# EasyEDA Pro project STM32F407ZG_Basics.epro, board PCB1
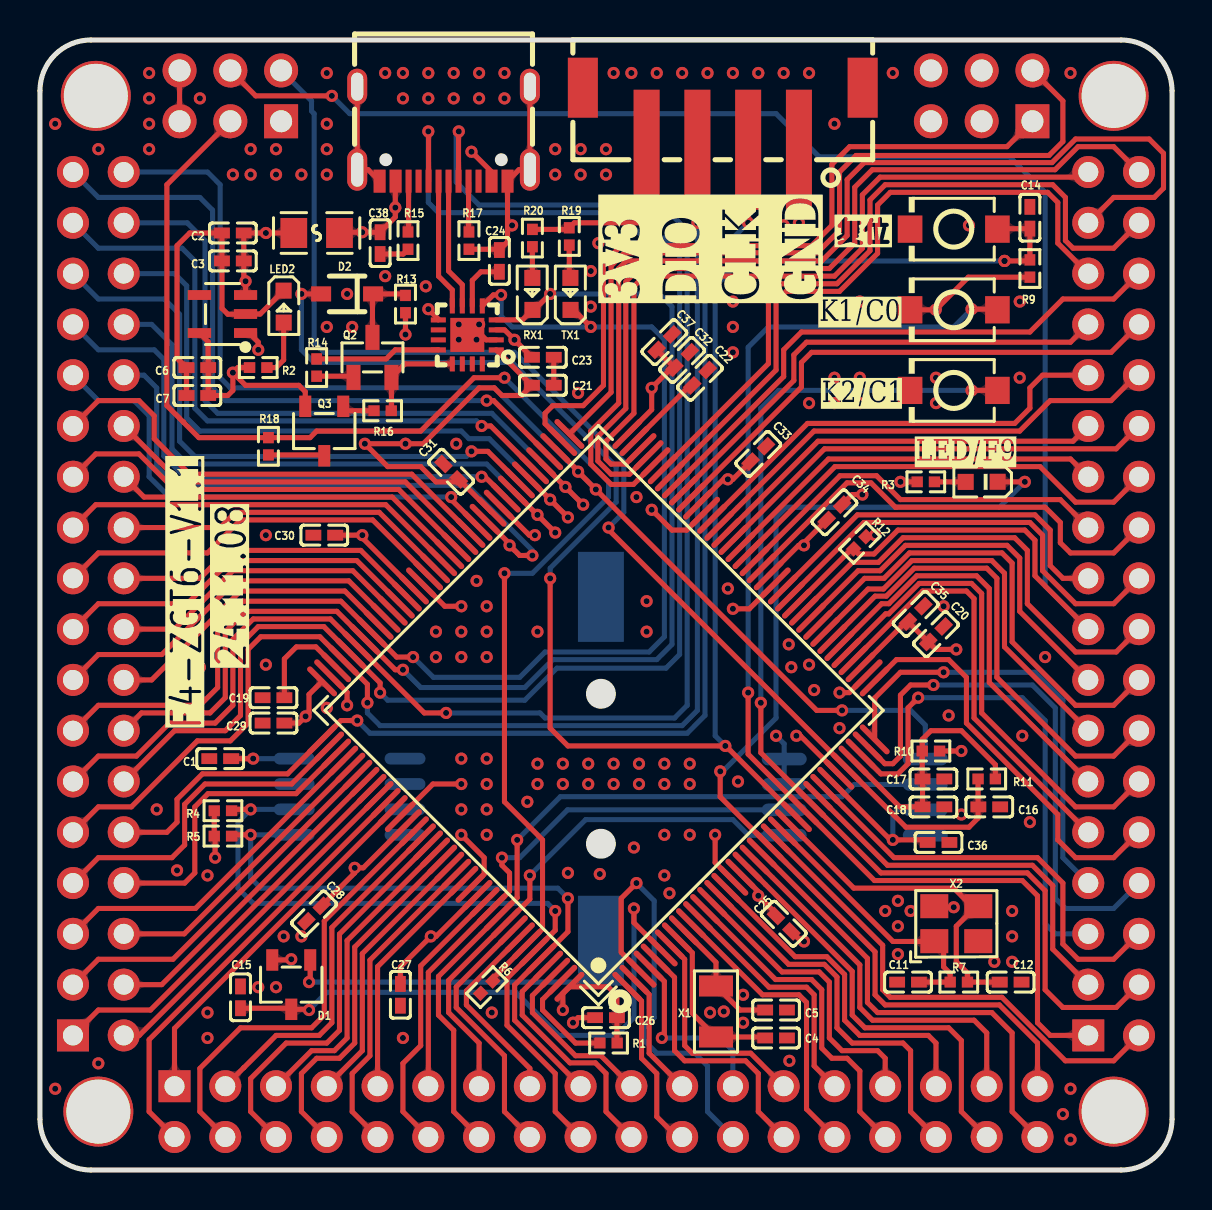
[diagram p1: board, top side]
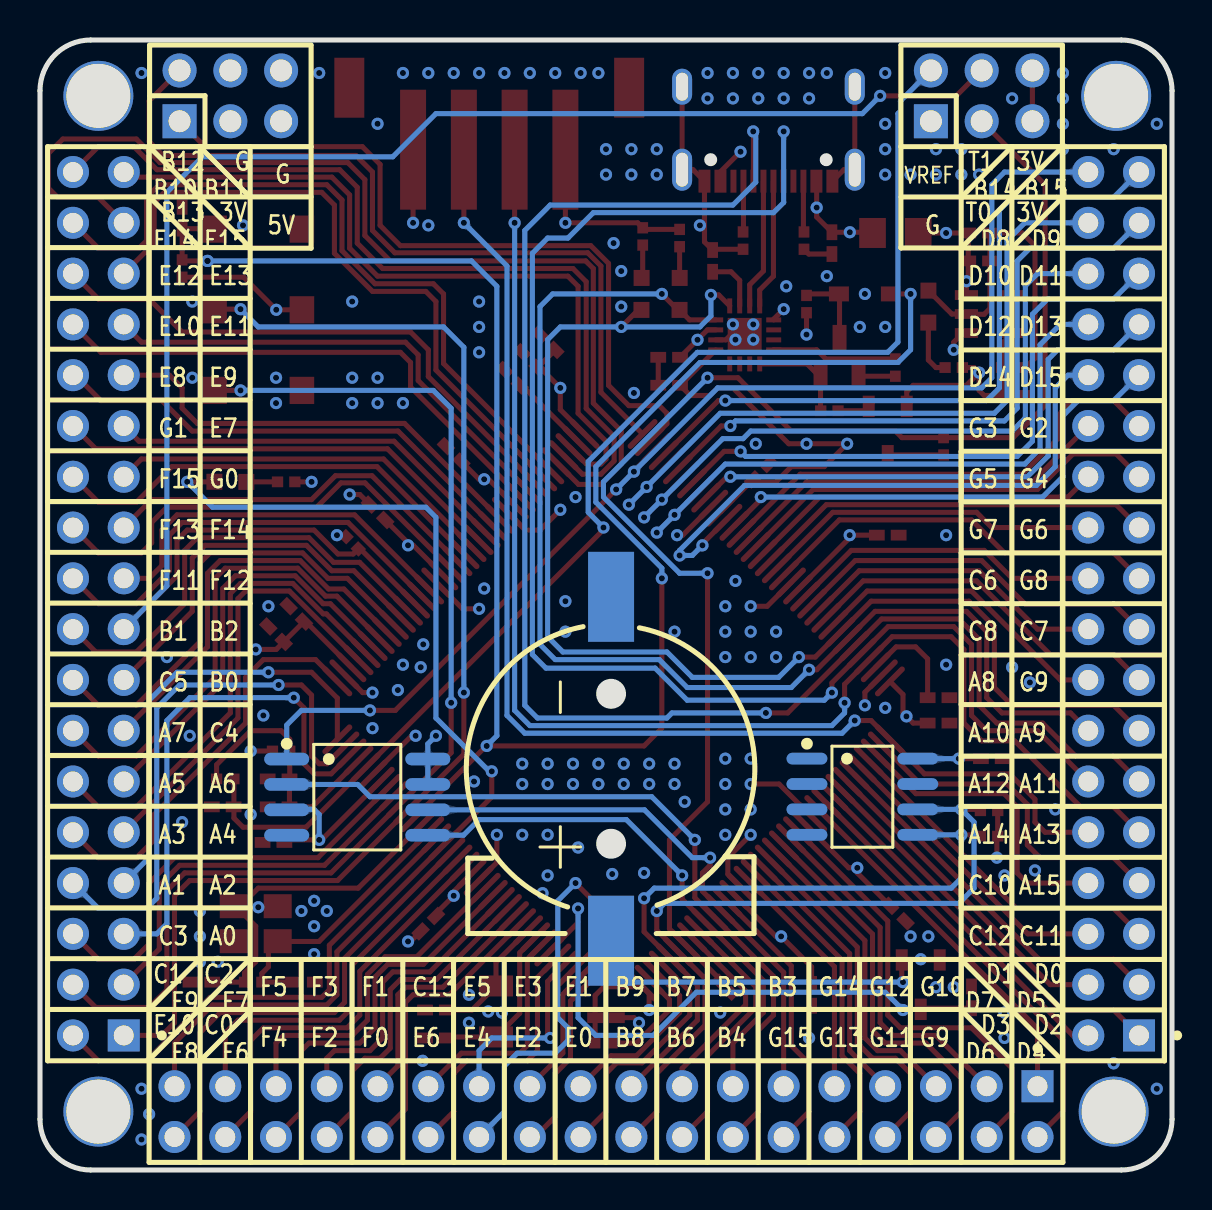
[diagram p2: board, bottom side, seen from below]

Outline 56.64 x 56.51 mm; copper layers: Top Layer, GND, VCC, Bottom Layer. Coordinates in mm from the lower left corner of the outline.
Outline path: 0,53.97 0,2.54 arc(0.74,0.74) 2.54,0 54.1,0 arc(55.9,0.74) 56.64,2.54 56.64,53.97 arc(55.9,55.77) 54.1,56.51 2.54,56.51 arc(0.74,55.77) 0,53.97
Stack: Top Layer 0.035mm 外层铜厚1oz / Dielectric1 0.2104mm 7628 RC49% 8.6mil / GND 0.0152mm 内层铜厚 / Dielectric2 1.065mm 1.1mm H/HOZ 含铜 / VCC 0.0152mm 内层铜厚 / Dielectric3 0.2104mm 7628 RC49% 8.6mil / Bottom Layer 0.035mm 外层铜厚1oz

## Design rules (mm)
template: JLCPCB Capability(Two Layers Board)
spacing copperThickness1oz (default): track to track 0.102, other pairs 0.152 to 0.3
spacing copperThickness2oz: track to track 0.203, other pairs 0.152 to 0.3
track width copperThickness1oz (default): min 0.127, default 0.254, max 2.54
track width copperThickness2oz: min 0.203, default 0.254, max 2.54
differential pair differentialPair (default): width min 0.127, default 0.254, max 2.54; gap min 0.152, default 0.152
via viaSize (default): diameter min 0.5, default 0.61, max 10; hole min 0.3, default 0.305, max 6.3

## Placement (name value [footprint] x y rotation side)
BT1  CR1220-2ZX  [BAT-SMD_CR1220-2ZX]  28.07 20.07 90 bottom
C1  100nF  [C0402]  9.02 20.57 0 top
C2  10uF  [C0402]  9.65 46.86 180 top
C3  100nF  [C0402]  9.65 45.47 0 top
C4  12pF  [C0402]  36.83 6.6 180 top
C5  12pF  [C0402]  36.83 8 180 top
C6  100nF  [C0402]  7.87 40.13 0 top
C7  10uF  [C0402]  7.87 38.73 180 top
C11  22pF  [C0402]  43.43 9.4 0 top
C12  22pF  [C0402]  48.57 9.4 180 top
C14  100nF  [C0402]  49.53 47.62 90 top
C15  100nF  [C0402]  10.03 8.64 270 top
C16  100nF  [C0402]  47.5 18.16 180 top
C17  10uF  [C0402]  44.7 19.56 180 top
C18  100nF  [C0402]  44.7 18.16 0 top
C19  2.2uF  [C0402]  11.68 23.62 180 top
C20  100nF  [C0402]  44.83 26.8 225 top
C21  1uF  [C0402]  25.16 39.25 180 top
C22  2.2uF  [C0402]  33.02 39.62 225 top
C23  100nF  [C0402]  25.16 40.65 180 top
C24  100nF  [C0402]  22.99 45.47 270 top
C25  100nF  [C0402]  37.21 12.32 315 top
C26  100nF  [C0402]  28.32 7.62 180 top
C27  100nF  [C0402]  18.03 8.76 270 top
C28  100nF  [C0402]  13.72 12.83 225 top
C29  100nF  [C0402]  11.68 22.35 180 top
C30  100nF  [C0402]  14.22 31.75 180 top
C31  100nF  [C0402]  20.57 34.92 135 top
C32  100nF  [C0402]  32.13 40.51 45 top
C33  100nF  [C0402]  35.94 35.81 45 top
C34  100nF  [C0402]  39.75 32.89 45 top
C35  100nF  [C0402]  43.81 27.81 45 top
C36  100nF  [C0402]  44.96 16.38 0 top
C37  10uF  [C0402]  31.24 41.4 225 top
C38  10uF  [C0402]  17.02 46.35 270 top
D1  SBAT54CLT1G  [SOT-23-3_L2.9-W1.6-P1.90-LS2.8-BR]  12.57 9.27 90 top
D2  1N5819WS  [SOD-323_L1.6-W1.3-LS2.6-RD-1]  15.37 43.81 180 top
F1  ASMD0805-075  [F0805]  13.84 46.86 180 top
H1  PH-01162  [HDR-TH_PH-01162]  53.72 28.32 90 bottom
H2  PH-01162  [HDR-TH_PH-01162]  28.32 2.92 0 bottom
H3  PH-01162  [HDR-TH_PH-01162]  2.92 28.32 90 bottom
H4  PZ254V-12-6P  [HDR-TH_6P-P2.54-V-M-R2-C3-S2.54]  9.53 53.72 180 bottom
H5  PZ254V-12-6P  [HDR-TH_6P-P2.54-V-M-R2-C3-S2.54]  47.12 53.72 180 bottom
LED1  XL-1608UGC-04  [LED0603-RD_GREEN]  47.12 34.42 180 top
LED2  XL-1608SURC-06  [LED0603-RD_RED]  12.19 43.18 270 top
NOREF  -  [Pad_e156]  53.72 2.92 0 top
NOREF#2  -  [Pad_e157]  2.92 2.92 0 top
NOREF#3  -  [Pad_e153]  2.79 53.72 0 top
NOREF#4  -  [Pad_e155]  53.72 53.72 0 top
Q2  L8050QLT1G  [SOT-23-3_L2.9-W1.3-P1.90-LS2.4-BR]  16.64 40.64 270 top
Q3  L8550QLT1G  [SOT-23-3_L2.9-W1.6-P1.90-LS2.8-BR]  14.22 36.96 90 top
R1  10kΩ  [R0402]  28.45 6.35 0 top
R2  1.5kΩ  [R0402]  10.92 40.13 180 top
R3  1.5kΩ  [R0402]  44.32 34.42 0 top
R4  5.1kΩ  [R0402]  9.15 17.97 180 top
R5  5.1kΩ  [R0402]  9.15 16.7 180 top
R6  10kΩ  [R0402]  22.35 9.14 225 top
R7  1MΩ  [R0402]  45.97 9.4 0 top
R9  10kΩ  [R0402]  49.53 45.08 270 top
R10  0Ω  [R0402]  44.58 20.95 180 top
R11  0Ω  [R0402]  47.37 19.56 180 top
R12  10kΩ  [R0402]  41.02 31.37 225 top
R13  10kΩ  [R0402]  18.29 43.31 270 top
R14  1.5kΩ  [R0402]  13.84 40.13 270 top
R15  5.1kΩ  [R0402]  18.42 46.48 270 top
R16  1.5kΩ  [R0402]  17.15 37.97 180 top
R17  5.1kΩ  [R0402]  21.46 46.48 270 top
R18  120Ω  [R0402]  11.43 36.19 270 top
R19  1.5kΩ  [R0402]  26.48 46.69 270 top
R20  1.5kΩ  [R0402]  24.64 46.61 270 top
RX1  XL-1608SURC-06  [LED0603-RD_RED]  24.64 43.81 90 top
SW1  TS-1088-AR02016  [SW-SMD_L3.9-W3.0-P4.45]  45.72 43.02 180 top
SW2  TS-1088-AR02016  [SW-SMD_L3.9-W3.0-P4.45]  45.72 38.99 180 top
SW3  TS-1088-AR02016  [SW-SMD_L3.9-W3.0-P4.45]  45.72 47.06 180 top
TX1  XL-1608SURC-06  [LED0603-RD_RED]  26.54 43.81 90 top
U1  TPRT9013-33GB  [SOT-23-5_L3.0-W1.7-P0.95-LS2.8-BL]  9.13 42.81 90 top
U2  STM32F407ZGT6  [LQFP-144_L20.0-W20.0-P0.50-LS22.0-BL]  27.94 22.99 45 top
U3  24C02CT/SN  [SOIC-8_L4.9-W3.9-P1.27-LS6.0-BL]  15.49 18.67 270 bottom
U4  ZX-XH2.54-4PLT  [CONN-SMD_4P-P2.54_C9900012758]  34.16 52.58 180 top
U5  W25Q128FVSIG  [SOIC-8_L5.3-W5.3-P1.27-LS8.0-BL]  40.77 18.65 270 bottom
U6  CH343P  [TQFN-16_L3.0-W3.0-P0.50-BL-EP1.7]  21.38 41.77 90 top
USB1  TYPE-C16PIN  [USB-C-SMD_TYPE-C16PIN]  20.19 51.82 180 top
X1  32.768kHz  [OSC-SMD_L3.2-W1.5]  33.82 7.93 90 top
X2  8MHz  [OSC-SMD_4P-L3.2-W2.5-BL]  45.85 12.32 0 top

## Footprints (pads in the part's own frame, mm; a bottom-side part is the same pattern mirrored in y, then rotated)
BAT-SMD_CR1220-2ZX
  rect 4.5x2.3 smd: 1(-8.6,0) 2(8.6,0)
C0402
  rect 0.79x0.54 smd: 1(-0.545,0) 2(0.545,0)
CONN-SMD_4P-P2.54_C9900012758
  rect 1.3x6 smd: 1(-3.811,1.55) 2(-1.27,1.55) 3(1.27,1.55) 4(3.81,1.55)
  rect 1.5x3 smd: 5(7,-1.55) 6(-7,-1.55)
F0805
  rect 1.335x1.5 smd: 1(-1.143,0) 2(1.143,0)
HDR-TH_6P-P2.54-V-M-R2-C3-S2.54
  rect 1.7x1.7 hole 1.1: 1(-2.54,-1.27)
  round 1.7 hole 1.1: 2(-2.54,1.27) 3(0,-1.27) 4(0,1.27) 5(2.54,-1.27) 6(2.54,1.27)
HDR-TH_PH-01162
  rect 1.6x1.6 hole 1: 1(-21.59,-1.27)
  round 1.6 hole 1: 2(-21.59,1.27) 3(-19.05,-1.27) 4(-19.05,1.27) 5(-16.51,-1.27) 6(-16.51,1.27) 7(-13.97,-1.27) 8(-13.97,1.27) 9(-11.43,-1.27) 10(-11.43,1.27) 11(-8.89,-1.27) 12(-8.89,1.27) 13(-6.35,-1.27) 14(-6.35,1.27) 15(-3.81,-1.27) 16(-3.81,1.27) 17(-1.27,-1.27) 18(-1.27,1.27) 19(1.27,-1.27) 20(1.27,1.27) 21(3.81,-1.27) 22(3.81,1.27) 23(6.35,-1.27) 24(6.35,1.27) 25(8.89,-1.27) 26(8.89,1.27) 27(11.43,-1.27) 28(11.43,1.27) 29(13.97,-1.27) 30(13.97,1.27) 31(16.51,-1.27) 32(16.51,1.27) 33(19.05,-1.27) 34(19.05,1.27) 35(21.59,-1.27) 36(21.59,1.27)
LED0603-RD_GREEN
  rect 0.8x0.8 smd: 1(-0.799,-0.004) 2(0.799,0.004)
LED0603-RD_RED
  rect 0.8x0.8 smd: 1(-0.799,-0.004) 2(0.799,0.004)
LQFP-144_L20.0-W20.0-P0.50-LS22.0-BL
  oval 0.28x2 smd: 1(-8.75,-10.8) 2(-8.25,-10.8) 3(-7.75,-10.8) 4(-7.25,-10.8) 5(-6.75,-10.8) 6(-6.25,-10.8) 7(-5.75,-10.8) 8(-5.25,-10.8) 9(-4.75,-10.8) 10(-4.25,-10.8) 11(-3.75,-10.8) 12(-3.25,-10.8) 13(-2.75,-10.8) 14(-2.25,-10.8) 15(-1.75,-10.8) 16(-1.25,-10.8) 17(-0.75,-10.8) 18(-0.25,-10.8) 19(0.25,-10.8) 20(0.75,-10.8) 21(1.25,-10.8) 22(1.75,-10.8) 23(2.25,-10.8) 24(2.75,-10.8) 25(3.25,-10.8) 26(3.75,-10.8) 27(4.25,-10.8) 28(4.75,-10.8) 29(5.25,-10.8) 30(5.75,-10.8) 31(6.25,-10.8) 32(6.75,-10.8) 33(7.25,-10.8) 34(7.75,-10.8) 35(8.25,-10.8) 36(8.75,-10.8) 73(8.75,10.8) 74(8.25,10.8) 75(7.75,10.8) 76(7.25,10.8) 77(6.75,10.8) 78(6.25,10.8) 79(5.75,10.8) 80(5.25,10.8) 81(4.75,10.8) 82(4.25,10.8) 83(3.75,10.8) 84(3.25,10.8) 85(2.75,10.8) 86(2.25,10.8) 87(1.75,10.8) 88(1.25,10.8) 89(0.75,10.8) 90(0.25,10.8) 91(-0.25,10.8) 92(-0.75,10.8) 93(-1.25,10.8) 94(-1.75,10.8) 95(-2.25,10.8) 96(-2.75,10.8) 97(-3.25,10.8) 98(-3.75,10.8) 99(-4.25,10.8) 100(-4.75,10.8) 101(-5.25,10.8) 102(-5.75,10.8) 103(-6.25,10.8) 104(-6.75,10.8) 105(-7.25,10.8) 106(-7.75,10.8) 107(-8.25,10.8) 108(-8.75,10.8)
  oval 2x0.28 smd: 37(10.8,-8.75) 38(10.8,-8.25) 39(10.8,-7.75) 40(10.8,-7.25) 41(10.8,-6.75) 42(10.8,-6.25) 43(10.8,-5.75) 44(10.8,-5.25) 45(10.8,-4.75) 46(10.8,-4.25) 47(10.8,-3.75) 48(10.8,-3.25) 49(10.8,-2.75) 50(10.8,-2.25) 51(10.8,-1.75) 52(10.8,-1.25) 53(10.8,-0.75) 54(10.8,-0.25) 55(10.8,0.25) 56(10.8,0.75) 57(10.8,1.25) 58(10.8,1.75) 59(10.8,2.25) 60(10.8,2.75) 61(10.8,3.25) 62(10.8,3.75) 63(10.8,4.25) 64(10.8,4.75) 65(10.8,5.25) 66(10.8,5.75) 67(10.8,6.25) 68(10.8,6.75) 69(10.8,7.25) 70(10.8,7.75) 71(10.8,8.25) 72(10.8,8.75) 109(-10.8,8.75) 110(-10.8,8.25) 111(-10.8,7.75) 112(-10.8,7.25) 113(-10.8,6.75) 114(-10.8,6.25) 115(-10.8,5.75) 116(-10.8,5.25) 117(-10.8,4.75) 118(-10.8,4.25) 119(-10.8,3.75) 120(-10.8,3.25) 121(-10.8,2.75) 122(-10.8,2.25) 123(-10.8,1.75) 124(-10.8,1.25) 125(-10.8,0.75) 126(-10.8,0.25) 127(-10.8,-0.25) 128(-10.8,-0.75) 129(-10.8,-1.25) 130(-10.8,-1.75) 131(-10.8,-2.25) 132(-10.8,-2.75) 133(-10.8,-3.25) 134(-10.8,-3.75) 135(-10.8,-4.25) 136(-10.8,-4.75) 137(-10.8,-5.25) 138(-10.8,-5.75) 139(-10.8,-6.25) 140(-10.8,-6.75) 141(-10.8,-7.25) 142(-10.8,-7.75) 143(-10.8,-8.25) 144(-10.8,-8.75)
OSC-SMD_4P-L3.2-W2.5-BL
  rect 1.4x1.2 smd: 1(-1.1,-0.875) 2(1.1,-0.875) 3(1.1,0.875) 4(-1.1,0.875)
OSC-SMD_L3.2-W1.5
  rect 1.05x1.7 smd: 1(-1.275,0) 2(1.275,0)
Pad_e153
  round 3.5 hole 3.2: 1(0,0)
Pad_e155
  round 3.5 hole 3.2: 2(0,0)
Pad_e156
  round 3.5 hole 3.2: 3(0,0)
Pad_e157
  round 3.5 hole 3.2: 4(0,0)
R0402
  rect 0.566x0.54 smd: 1(-0.433,0) 2(0.433,0)
SOD-323_L1.6-W1.3-LS2.6-RD-1
  rect 1x0.75 smd: 1(-1.3,0) 2(1.3,0)
SOIC-8_L4.9-W3.9-P1.27-LS6.0-BL
  oval 0.588x2.045 smd: 1(-1.905,-2.772) 2(-0.635,-2.772) 3(0.635,-2.772) 4(1.905,-2.772) 5(1.905,2.772) 6(0.635,2.772) 7(-0.635,2.772) 8(-1.905,2.772)
SOIC-8_L5.3-W5.3-P1.27-LS8.0-BL
  oval 0.63x2.25 smd: 1(-1.905,-3.53) 2(-0.635,-3.53) 3(0.635,-3.53) 4(1.905,-3.53) 5(1.905,3.53) 6(0.635,3.53) 7(-0.635,3.53) 8(-1.905,3.53)
SOT-23-3_L2.9-W1.3-P1.90-LS2.4-BR
  rect 1.25x0.7 smd: 1(1,-0.95) 2(1,0.95) 3(-1,0)
SOT-23-3_L2.9-W1.6-P1.90-LS2.8-BR
  rect 1.07x0.6 smd: 1(1.235,-0.95) 2(1.235,0.95) 3(-1.235,0)
SOT-23-5_L3.0-W1.7-P0.95-LS2.8-BL
  rect 0.49x1.157 smd: 1(-0.95,-1.153) 2(0,-1.153) 3(0.95,-1.153)
  rect 0.49x1.175 smd: 4(0.95,1.153) 5(-0.95,1.153)
SW-SMD_L3.9-W3.0-P4.45
  rect 1.23x1.36 smd: 1(-2.185,0) 2(2.185,0)
TQFN-16_L3.0-W3.0-P0.50-BL-EP1.7
  rect 0.25x0.75 smd: 1(-0.749,-1.45) 2(-0.248,-1.45) 3(0.252,-1.45) 4(0.751,-1.45) 9(0.75,1.45) 10(0.25,1.45) 11(-0.25,1.45) 12(-0.749,1.45)
  rect 0.75x0.25 smd: 5(1.45,-0.75) 6(1.45,-0.25) 7(1.45,0.25) 8(1.45,0.75) 13(-1.45,0.75) 14(-1.45,0.25) 15(-1.45,-0.25) 16(-1.45,-0.75)
  rect 1.7x1.7 smd: 17(0.001,0)
USB-C-SMD_TYPE-C16PIN
  oval 1x2.1 hole 0.6x1.7: 1(-4.32,1.788) 2(4.32,1.788)
  oval 1x1.8 hole 0.6x1.4: 3(-4.32,-2.362) 4(4.32,-2.362)
  rect 0.6x1.15 smd: A1B12(-3.2,2.362) A4B9(-2.4,2.362) B1A12(3.2,2.362) B4A9(2.4,2.362)
  rect 0.3x1.15 smd: A5(-1.25,2.362) A6(-0.25,2.362) A7(0.25,2.362) A8(-1.75,2.362) B5(1.75,2.362) B6(0.75,2.362) B7(-0.75,2.362) B8(1.25,2.362)

## Nets
3V3: C1.2 C6.2 C7.1 C20.2 C21.2 C25.1 C26.1 C27.1 C28.1 C29.1 C30.1 C31.1 C32.1 C33.1 C34.1 C35.1 C36.1 C37.2 D1.2 H4.5 H4.6 H5.3 Q3.2 R1.2 R2.2 R3.1 R4.2 R5.2 R9.2 R10.1 R13.2 R19.1 R20.1 SW1.2 U1.5 U2.17 U2.30 U2.39 U2.52 U2.62 U2.72 U2.84 U2.95 U2.108 U2.121 U2.131 U2.144 U3.8 U4.4 U5.3 U5.7 U5.8 U6.1
+5V: C2.1 C3.2 C23.2 F1.2 H5.5 U1.1 U1.3 U6.3 U6.9
GND: BT1.2 C1.1 C2.2 C3.1 C4.1 C5.1 C6.1 C7.2 C11.1 C12.1 C14.2 C15.1 C16.1 C17.1 C18.2 C19.2 C20.1 C21.1 C22.1 C23.1 C24.1 C25.2 C26.2 C27.2 C28.2 C29.2 C30.2 C31.2 C32.2 C33.2 C34.2 C35.2 C36.2 C37.1 C38.2 H4.1 H5.4 H5.6 LED2.1 R6.2 R12.1 R15.2 R17.2 SW2.2 SW3.2 U1.2 U2.16 U2.31 U2.38 U2.51 U2.61 U2.83 U2.94 U2.107 U2.120 U2.130 U3.1 U3.2 U3.3 U3.4 U3.7 U4.1 U5.4 U6.2 U6.17 USB1.1 USB1.2 USB1.3 USB1.4 USB1.A1B12 USB1.B1A12 X2.2 X2.4
VBUS: C38.1 F1.1 USB1.A4B9 USB1.B4A9
VDDA: C17.2 C18.1 R10.2 R11.1 U2.33
BOOT0: H4.3 R6.1 R18.1 U2.138
CS_F: H3.36 U2.75 U5.1
DN/D-: U6.8 USB1.A7
DP/D+: U6.7 USB1.A6
DTR: R14.1 U6.12
IIC_SCL: H2.18 R4.1 U2.139 U3.6
IIC_SDA: H2.17 R5.1 U2.140 U3.5
PA0: H1.5 U2.34
PA1: H1.8 U2.35
PA2: H1.7 U2.36
PA3: H1.10 U2.37
PA4: H1.9 U2.40
PA5: H1.12 U2.41
PA6: H1.11 U2.42
PA7: H1.14 U2.43
PA8: H3.16 U2.100
PA9/TX1: H3.13 TX1.1 U2.101 U6.5
PA10/RX1: H3.14 RX1.1 U2.102 U6.4
PA11/USB_D-: H3.11 U2.103 USB1.B7
PA12/USB_D+: H3.12 U2.104 USB1.B6
PA13/SWDIO: H3.9 U2.105 U4.3
PA14/SWCLK: H3.10 U2.109 U4.2
PA15: H3.7 U2.110
PB0: H1.15 U2.46
PB1: H1.18 U2.47
PB2/BOOT1: H1.17 H4.4 R12.2 U2.48
PB3: H2.11 U2.133 U5.6
PB4: H2.14 U2.134 U5.2
PB5: H2.13 U2.135 U5.5
PB6: H2.16 U2.136
PB7: H2.15 U2.137
PB10: H1.36 U2.69
PB11: H1.35 U2.70
PB12: H5.2 U2.73
PB13: H5.1 U2.74
PB15: H3.35 U2.76
PC0/K1: H1.1 SW1.1 U2.26
PC1/K2: H1.4 SW2.1 U2.27
PC2: H1.3 U2.28
PC3: H1.6 U2.29
PC4: H1.13 U2.44
PC5: H1.16 U2.45
PC6: H3.20 U2.96
PC7: H3.17 U2.97
PC8: H3.18 U2.98
PC9: H3.15 U2.99
PC10: H3.8 U2.111
PC11: H3.5 U2.112
PC12: H3.6 U2.113
PC13: H2.25 U2.7
PC14: C4.2 U2.8 X1.1
PC15: C5.2 U2.9 X1.2
PD0: H3.3 U2.114
PD1: H3.4 U2.115
PD2: H3.1 U2.116
PD3: H3.2 U2.117
PD4: H2.2 U2.118
PD5: H2.1 U2.119
PD6: H2.4 U2.122
PD7: H2.3 U2.123
PD8: H3.34 U2.77
PD9: H3.33 U2.78
PD10: H3.32 U2.79
PD11: H3.31 U2.80
PD12: H3.30 U2.81
PD13: H3.29 U2.82
PD14: H3.28 U2.85
PD15: H3.27 U2.86
PE0: H2.20 U2.141
PE1: H2.19 U2.142
PE2: H2.22 U2.1
PE3: H2.21 U2.2
PE4: H2.24 U2.3
PE5: H2.23 U2.4
PE6: H2.26 U2.5
PE7: H1.25 U2.58
PE8: H1.28 U2.59
PE9: H1.27 U2.60
PE10: H1.30 U2.63
PE11: H1.29 U2.64
PE12: H1.32 U2.65
PE13: H1.31 U2.66
PE14: H1.34 U2.67
PE15: H1.33 U2.68
PF0: H2.28 U2.10
PF1: H2.27 U2.11
PF2: H2.30 U2.12
PF3: H2.29 U2.13
PF4: H2.32 U2.14
PF5: H2.31 U2.15
PF6: H2.34 U2.18
PF7: H2.33 U2.19
PF8: H2.36 U2.20
PF9/TIM14_CH1: H2.35 LED1.1 U2.21
PF10: H1.2 U2.22
PF11: H1.20 U2.49
PF12: H1.19 U2.50
PF13: H1.22 U2.53
PF14: H1.21 U2.54
PF15: H1.24 U2.55
PG0: H1.23 U2.56
PG1: H1.26 U2.57
PG2: H3.25 U2.87
PG3: H3.26 U2.88
PG4: H3.23 U2.89
PG5: H3.24 U2.90
PG6: H3.21 U2.91
PG7: H3.22 U2.92
PG8: H3.19 U2.93
PG9: H2.6 U2.124
PG10: H2.5 U2.125
PG11: H2.8 U2.126
PG12: H2.7 U2.127
PG13: H2.10 U2.128
PG14: H2.9 U2.129
PG15: H2.12 U2.132
PH0: C11.2 R7.1 U2.23 X2.1
PH1: C12.2 R7.2 U2.24 X2.3
POWER: C15.2 D1.3 U2.6
RST: C14.1 D2.2 R9.1 SW3.1 U2.25
RTS: Q2.2 R16.1 U6.13
VREF: C16.2 H4.2 R11.2 U2.32
$1N3432: R1.1 U2.143
$1N3503: C19.1 U2.106
$1N3607: C22.2 U2.71
$1N5532: BT1.1 D1.1
$1N6115: LED2.2 R2.1
$1N7262: R15.1 USB1.B5
$1N7303: R17.1 USB1.A5
$1N7864: C24.2 U6.6
$1N8061: R19.2 TX1.2
$1N8103: R20.2 RX1.2
$1N8304: Q2.1 R14.2
$1N8343: D2.1 Q2.3 R13.1
$1N8469: Q3.1 R16.2
$1N18412: LED1.2 R3.2
$1N26831: Q3.3 R18.2

Pads without a net: NOREF 3; NOREF#2 4; NOREF#3 1; NOREF#4 2; U1 4; U4 5 6; U6 10 11 14 15 16; USB1 A8 B8

## Via types
v1: diameter 0.61, hole 0.305, Top Layer to Bottom Layer, 270 vias

## Routing (per net, layer and track width the routed paths; a pad name or vN(x,y) marks a point on that pad's centre or on a via; arc(x,y) is an arc through that point)
3V3: length 120.4
  Top Layer w0.254: D1.2 12.54,10.51 v1(12.57,10.54) ; v1(26.16,8) 26.16,8.83 26.49,9.16 28.43,9.16 28.87,8.73 C26.1 28.87,6.36 R1.2 ; H4.6 H4.5 ; C30.1 v1(16.13,31.75) 16.13,31.62 18.71,29.03 ; R20.1 26.4,47.04 R19.1 26.73,47.37 v1(30.35,47.37) U4.4 ; R13.2 v1(18.29,41.78) ; C29.1 12.95,22.35 13.46,22.86 13.46,23.78 U2.108 ; 22.6,32.92 22.58,32.92 C31.1 20.84,34.42 19.81,34.42 19.05,35.18 17.4,35.18 v1(16.26,36.32) v1(18.29,36.32) 19.18,36.32 21.97,39.12 22.73,39.12 23.11,38.73 24.1,38.73 C21.2 24.6,39.25 22.83,41.02 ; C37.2 C32.1 31.62,40.13 v1(30.61,39.12) 30.61,38.03 U2.72 ; C25.1 36.83,12.83 v1(35.94,13.72) 35.94,13.93 U2.17 ; SW1.2 v1(44.82,43.02) 46.45,44.65 R9.2 ; R4.2 R5.2 8.76,16.66 v1(8.76,15.62) ; v1(9.65,39.88) 10.29,39.24 12.95,39.24 13.27,38.92 Q3.2 ; v1(9.65,39.88) 9.91,40.13 R2.2 ; v1(9.65,39.88) 9.65,38.99 9.4,38.73 8.42,38.73 8.42,41.42 U1.5 ; C28.1 15.75,14.86 v1(15.75,15.11) 16.18,15.11 U2.121 ; C33.1 34.67,34.54 v1(34.42,34.54) 34.19,34.54 32.93,33.28 ; R10.1 v1(46.1,20.95) ; v1(43.05,34.42) R3.1 ; U2.30 42.55,16.51 v1(42.67,16.51) 44.29,16.51 C36.1 ; v1(45.85,26.03) 44.82,26.03 C20.2 C35.1 43.34,27.43 U2.39 ; C27.1 18.03,10.16 v1(19.56,11.68) 19.82,11.68 21.89,13.76 ; U2.52 37.96,31.24 v1(38.23,31.24) 38.23,31.37 C34.1 ; v1(10.67,20.57) C1.2
  Bottom Layer w0.254: 44.3,18.01 44.28,18.03 42.93,18.03 42.67,17.78 v1(42.67,16.51) ; U5.7 U5.8 37.24,21.31 v1(36.83,21.72) ; v1(10.67,20.57) 12.34,20.57
  vias: v1(13.29,22.69)
+5V: length 9.9
  Top Layer w0.254: v1(19.43,43.05) 19.93,42.55 U6.9 ; U1.3 v1(10.29,44.45) 10.2,44.54 C3.2 C2.1 v1(11.3,46.86) F1.2 ; v1(10.92,41.02) 10.92,41.4 10.46,41.86 U1.1 ; 22.83,42.02 23.25,42.02 v1(23.74,41.52) C23.2
GND: length 72.8
  Top Layer w0.254: v1(38.23,11.43) 38.1,11.43 C25.2 ; v1(30.61,33.02) 31.62,32 32.36,32 33.28,32.92 ; LED2.1 11.02,42.81 U1.2 10.28,42.8 9.4,42.8 9.11,43.09 C3.1 C2.2 7.49,46.86 6.86,46.23 6.86,40.6 C6.1 C7.2 ; C26.2 26.92,7.62 v1(26.67,7.37) ; U6.17 22.08,41.77 22.33,41.52 22.83,41.52 ; v1(40,23.88) 40.5,23.88 U2.38 ; v1(37.85,21.72) 38.05,21.72 U2.31 ; v1(15.37,23.24) 15.37,23.89 U2.107 ; U2.130 22.22,14.8 22.22,15.62 v1(21.08,16.76) ; 18.42,46.05 18.18,45.81 C38.2 ; 22.96,33.28 24.48,31.75 v1(24.77,31.75) ; v1(33.78,16.76) 33.78,15.38 U2.16 ; 16.99,49.45 16.42,50.03 USB1.2 USB1.4 ; U4.1 v1(37.97,47.37) ; C21.1 C23.1 ; v1(41.15,33.78) 40.64,33.78 C34.2 ; v1(34.67,28.07) 35.5,28.07 U2.51 ; v1(21.08,19.3) 19.66,19.3 18,17.65 ; U2.94 20.26,28.19 v1(21.08,28.19) ; USB1.3 USB1.1 23.97,50.03 USB1.A1B12 23.39,46.42 22.99,46.01 22.95,46.05 21.46,46.05
  vias: v1(0.76,52.32) v1(0.76,4.06) v1(2.92,51.05) v1(2.92,5.33) v1(5.46,54.86) v1(5.46,53.59) v1(5.46,52.32) v1(5.46,51.05) v1(5.84,18.03) v1(6.86,14.99) v1(7.11,24.38) v1(8,53.59) v1(8,25.15) v1(8.38,14.73) v1(8.38,7.87) v1(8.38,6.6) v1(9.65,49.78) v1(10.54,51.05) v1(10.54,49.78) v1(10.92,9.14) v1(11.3,31.75) v1(11.3,25.27) v1(11.81,51.05) v1(11.81,49.78) v1(11.81,9.14) v1(12.19,11.68) v1(13.08,49.78) v1(13.08,11.68) v1(14.35,54.86) v1(14.35,52.32) v1(14.35,51.05) v1(14.35,49.78) v1(14.35,42.16) v1(14.35,23.11) v1(15.37,43.81) v1(15.62,42.16) v1(17.27,54.86) v1(17.27,44.7) v1(18.16,54.86) v1(18.16,53.59) v1(18.16,6.6) v1(19.3,44.2) v1(19.43,54.86) v1(19.43,53.59) v1(19.81,26.92) v1(19.81,25.65) v1(20.7,54.86) v1(20.7,53.59) v1(20.83,36.32) v1(20.96,42.29) v1(20.96,41.53) v1(21.08,26.92) v1(21.08,25.65) v1(21.08,20.57) v1(21.08,18.03) v1(21.84,41.53) v1(21.84,29.46) v1(21.97,54.86) v1(21.97,53.59) v1(21.97,42.29) v1(22.35,28.19) v1(22.35,26.92) v1(22.35,25.65) v1(22.35,20.57) v1(22.35,19.3) v1(22.35,18.03) v1(22.35,16.76) v1(22.61,7.87) v1(23.24,54.86) v1(23.24,53.59) v1(23.62,47.24) v1(24.38,18.41) v1(24.89,26.92) v1(24.89,20.32) v1(24.89,19.3) v1(25.78,51.05) v1(25.78,49.78) v1(26.16,20.32) v1(26.16,19.3) v1(26.42,14.86) v1(26.92,38.86) v1(27.05,51.05) v1(27.05,49.78) v1(27.43,20.32) v1(27.43,19.3) v1(27.56,44.96) v1(27.56,43.18) v1(27.94,46.35) v1(28.01,14.8) v1(28.32,51.05) v1(28.32,49.78) v1(28.7,54.86) v1(28.7,20.32) v1(28.7,19.3) v1(29.59,54.86) v1(29.72,16.13) v1(29.84,33.65) v1(29.97,20.32) v1(29.97,19.3) v1(30.35,28.45) v1(30.35,26.92) v1(30.86,54.86) v1(31.24,20.32) v1(31.24,19.3) v1(31.24,16.76) v1(31.24,14.73) v1(31.5,13.84) v1(32.13,54.86) v1(32.51,20.32) v1(32.51,19.3) v1(32.51,16.76) v1(33.4,54.86) v1(33.53,7.87) v1(34.21,7.93) v1(34.42,29.08) v1(34.67,54.86) v1(34.67,43.43) v1(34.67,42.16) v1(34.67,40.89) v1(34.93,19.43) v1(35.18,8.76) v1(35.18,7.37) v1(35.94,54.86) v1(37.21,54.86) v1(37.21,47.24) v1(37.47,26.29) v1(37.5,5.46) v1(37.59,25.15) v1(38.48,54.86) v1(38.48,38.35) v1(38.48,25.27) v1(38.74,24) v1(39.75,52.32) v1(39.75,39.62) v1(39.75,38.35) v1(40,22.1) v1(41.02,43.43) v1(41.02,39.62) v1(41.02,38.35) v1(41.78,31.75) v1(42.29,12.95) v1(42.67,54.86) v1(42.93,13.46) v1(42.93,12.19) v1(42.93,10.79) v1(43.56,12.95) v1(44.83,39.62) v1(44.83,38.35) v1(45.21,28.19) v1(45.47,22.73) v1(45.72,13.14) v1(46.1,17.78) v1(46.48,47.24) v1(47.75,10.41) v1(48.64,12.95) v1(48.64,11.68) v1(48.64,10.41) v1(49.02,43.43) v1(49.02,39.62) v1(49.15,21.72) v1(49.53,17.4) v1(50.29,25.65) v1(51.18,2.79) v1(51.56,54.86) v1(51.56,4.06) v1(51.56,1.52)
VBUS: length 6.8
  Top Layer w0.254: F1.1 15.02,46.9 v1(16.12,46.9) C38.1 17.78,47.66 v1(17.78,48.13) 17.78,49.44 USB1.B4A9 ; USB1.A4B9 22.59,49.92 v1(21.59,50.93)
VDDA: length 13.1
  Top Layer w0.254: R11.1 47.8,20.27 46.1,21.97 44.58,21.97 44.14,21.54 R10.2 44.14,19.57 C17.2 C18.1 43.02,18.16 U2.33
BOOT0: length 71.5
  Top Layer w0.254: 7.18,37.4 7.95,36.63 R18.1 13.51,36.63 13.84,36.96 19.05,36.96 21.72,39.62 v1(23.24,39.62) ; 7.18,37.4 6.35,38.23 6.35,49.28 H4.3 ; 7.18,37.4 7.19,37.41 ; v1(23.24,29.84) 23.24,18.41 25.15,16.51 25.15,12.06 24.37,11.28 22.66,9.57 R6.1
  Bottom Layer w0.254: v1(23.24,39.62) 28.45,34.42 28.45,33.65 24.64,29.84 v1(23.24,29.84)
CS_F: length 61.8
  Top Layer w0.254: v1(40.13,22.99) 38.86,22.99 v1(27.81,34.04) v1(26.92,34.92) 26.92,34.96 U2.75
  Bottom Layer w0.254: v1(27.81,34.04) v1(26.92,34.92) 22.73,39.12 9.53,39.12 9.02,39.62 9.02,49.28 8.38,49.91 H3.36 ; v1(40.13,22.99) 43.56,22.99 44.3,22.25 U5.1
DN/D-: length 6.5
  Top Layer w0.254: U6.8 20.63,44.01 19.94,44.7 USB1.A7
DP/D+: length 6.5
  Top Layer w0.254: USB1.A6 20.44,44.96 21.13,44.27 U6.7
DTR: length 6.3
  Top Layer w0.254: R14.1 17.32,40.56 17.78,41.02 19.93,41.02 U6.12
IIC_SCL: length 37.2
  Top Layer w0.254: v1(25.78,12.95) 25.78,11.99 U2.139 23.37,9.58 23.37,7.24 25.78,4.83 25.78,2.92 27.05,1.65 ; R4.1 9.65,18.03 v1(10.54,18.03)
  Bottom Layer w0.254: 12.34,18.03 v1(10.54,18.03) 9.91,17.4 9.91,14.1 10.67,13.33 25.4,13.33 v1(25.78,12.95)
IIC_SDA: length 33.1
  Top Layer w0.254: R5.1 9.65,16.76 v1(10.54,16.76) ; 27.05,4.19 23.75,7.49 23.75,9.25 U2.140 26.42,11.92 v1(26.42,13.59)
  Bottom Layer w0.254: v1(26.42,13.59) 25.91,14.1 11.05,14.1 10.54,14.6 v1(10.54,16.76) 12.34,16.76
PA0: length 25.9
  Top Layer w0.254: U2.34 42.08,19.81 42.93,19.81 43.43,20.32 43.43,23.11 v1(43.94,23.62)
  Bottom Layer w0.254: v1(43.94,23.62) 49.15,23.62 50.29,22.48 50.29,12.32 50.8,11.81 H1.5
PA1: length 28.1
  Top Layer w0.254: U2.35 42.27,20.32 42.67,20.32 43.05,20.7 43.05,23.75 43.56,24.26 v1(44.7,24.26)
  Bottom Layer w0.254: H1.8 53.72,13.08 51.31,13.08 50.8,13.59 50.8,23.11 49.66,24.26 v1(44.7,24.26)
PA2: length 22.3
  Top Layer w0.254: v1(45.21,24.89) 43.05,24.89 41.76,23.6 U2.36
  Bottom Layer w0.254: v1(45.21,24.89) 49.78,24.89 51.18,23.49 51.18,15.62 H1.7
PA3: length 20.4
  Top Layer w0.254: H1.10 53.72,15.62 51.82,15.62 50.93,16.51 50.93,17.78 46.36,22.35 46.36,24.64 45.47,25.53 42.85,25.53 U2.37
PA4: length 21.7
  Top Layer w0.254: H1.9 46.74,22.61 46.74,28.57 46.36,28.96 44.16,28.96 U2.40
PA5: length 24.7
  Top Layer w0.254: U2.41 42.31,27.81 42.47,27.81 43.99,29.34 46.61,29.34 47.12,28.83 47.12,22.86 51.82,18.16 53.72,18.16 H1.12
PA6: length 20.9
  Top Layer w0.254: U2.42 42.11,28.32 42.47,28.32 43.87,29.72 46.86,29.72 47.5,29.08 47.5,24.38 H1.11
PA7: length 24.1
  Top Layer w0.254: U2.43 41.79,28.7 42.35,28.7 43.75,30.1 47.37,30.1 47.88,29.59 47.88,24.64 51.82,20.7 53.72,20.7 H1.14
PA8: length 15.3
  Top Layer w0.254: 16.94,27.26 15.25,28.96 10.03,28.96 5.59,24.51 H3.16
PA9/TX1: length 63.6
  Top Layer w0.254: TX1.1 26.71,43.02 v1(27.56,42.16) ; v1(23.07,43.77) 22.68,43.77 U6.5 ; H3.13 2.92,23.24 8,23.24 8.89,24.13 8.89,27.18 10.16,28.45 15.05,28.45 17.85,25.65 v1(18.67,25.65)
  Bottom Layer w0.254: v1(23.07,43.77) 23.07,42.71 23.62,42.16 v1(27.56,42.16) 30.61,42.16 31.24,41.53 31.24,26.67 30.48,25.91 25.27,25.91 24,24.64 19.69,24.64 v1(18.67,25.65)
PA10/RX1: length 60.8
  Top Layer w0.254: v1(25.53,43.81) 24.73,43.02 RX1.1 24.14,42.52 22.83,42.52 ; v1(18.16,25.02) 17.78,25.02 U2.102 14.86,27.94 10.29,27.94 9.27,26.92 9.27,23.62 8.51,22.86 5.08,22.86 H3.14
  Bottom Layer w0.254: v1(25.53,43.81) 30.99,43.81 31.62,43.18 31.62,26.29 30.86,25.53 25.65,25.53 24.26,24.13 19.05,24.13 v1(18.16,25.02)
PA11/USB_D-: length 79.7
  Top Layer w0.254: v1(20.96,51.94) 20.94,51.93 USB1.B7 ; H3.11 2.92,20.7 4.83,20.7 6.48,22.35 8.76,22.35 9.65,23.24 9.65,26.54 10.67,27.56 14.53,27.56 U2.103 19.23,22.86 v1(20.32,22.86)
  Bottom Layer w0.254: v1(20.96,51.94) 20.83,51.82 20.83,49.4 21.97,48.26 31.12,48.26 32.39,46.99 32.39,23.24 31.75,22.61 25.27,22.61 25.02,22.86 v1(20.32,22.86)
PA12/USB_D+: length 75.6
  Top Layer w0.254: v1(17.02,23.88) 17.02,24.36 U2.104 14.2,27.18 10.92,27.18 10.03,26.29 10.03,22.73 9.27,21.97 6.73,21.97 H3.12 ; USB1.B6 19.44,51.93 v1(19.43,51.94)
  Bottom Layer w0.254: v1(19.43,51.94) 19.43,48.39 19.94,47.88 28.96,47.88 30.23,46.61 31.24,46.61 32,45.85 32,25.78 31.32,25.1 25.86,25.1 24.26,23.49 17.4,23.49 v1(17.02,23.88)
PA13/SWDIO: length 68.5
  Top Layer w0.254: 32.89,47.37 U4.3 ; v1(16.38,23.37) 16.38,24.29 U2.105 14,26.67 11.05,26.67 10.41,26.03 10.41,22.35 9.53,21.46 7.87,21.46 4.57,18.16 2.92,18.16 H3.9
  Bottom Layer w0.254: v1(16.38,23.37) 16.38,22.86 17.02,22.22 32.13,22.22 32.89,22.99 v1(32.89,47.37)
PA14/SWCLK: length 61.9
  Top Layer w0.254: v1(15.88,22.48) 15.06,22.48 U2.109 12.39,19.81 8.13,19.81 6.86,18.54 6.86,17.4 6.35,16.89 H3.10 ; v1(35.43,47.37) U4.2
  Bottom Layer w0.254: v1(35.43,47.37) 33.27,45.21 33.27,22.73 32.39,21.84 16.51,21.84 v1(15.88,22.48)
PA15: length 16.8
  Top Layer w0.254: H3.7 2.92,15.62 6.6,15.62 7.24,16.26 7.24,18.29 8.25,19.3 12.59,19.3 U2.110
PB0: length 19.7
  Top Layer w0.254: H1.15 49.02,27.94 49.02,30.61 48.39,31.24 43.31,31.24 42.04,29.97 40.94,29.97 U2.46
PB1: length 22.7
  Top Layer w0.254: H1.18 53.85,25.91 51.82,25.91 49.4,28.32 49.4,30.99 48.77,31.62 43.19,31.62 41.95,30.39 40.65,30.39 U2.47
PB2/BOOT1: length 85.4
  Top Layer w0.254: H1.17 49.78,29.72 49.78,31.5 49.28,32 42.93,32 41.73,30.81 40.97,30.81 40.72,31.06 40.61,31.06 37.88,28.33 ; H4.4 10.8,53.72 v1(14.61,53.72)
  Bottom Layer w0.254: v1(14.61,53.72) 15.49,52.83 36.83,52.83 38.99,50.67 48.51,50.67 50.29,48.89 50.29,29.21 H1.17
PB3: length 28.4
  Top Layer w0.254: H2.11 19.43,9.88 23.5,13.95 23.5,14.86 23.11,15.24 v1(23.11,15.62)
  Bottom Layer w0.254: v1(23.11,15.62) 24,15.62 26.4,18.01 37.24,18.01
PB4: length 38.9
  Top Layer w0.254: H2.14 20.7,2.92 20.7,6.98 19.94,7.75 19.94,9.68 23.88,13.62 v1(23.88,16.51)
  Bottom Layer w0.254: U5.2 40.75,19.28 40.13,18.67 26.03,18.67 v1(23.88,16.51)
PB5: length 27.1
  Top Layer w0.254: H2.13 21.97,6.35 20.45,7.87 20.45,9.48 U2.135 24.51,13.55 v1(24.51,14.73)
  Bottom Layer w0.254: v1(24.51,14.73) 27.31,17.53 34.67,17.53 35.45,16.74 U5.5
PB6: length 13
  Top Layer w0.254: H2.16 23.24,2.92 23.24,5.71 20.83,8.13 20.83,9.16 U2.136
PB7: length 9.9
  Top Layer w0.254: H2.15 24.51,5.08 21.34,8.25 21.34,8.96 U2.137
PB10: length 43.4
  Top Layer w0.254: H1.36 53.72,51.18 51.94,51.18 50.79,50.03 41.65,50.03 40.77,49.15 40.77,46.35 39.5,45.08 29.97,45.08 29.31,44.42 29.31,38.09 27.92,36.69 27.92,35.46 28.58,34.8 29.5,34.8 U2.69
PB11: length 38.1
  Top Layer w0.254: U2.70 29.3,35.31 28.58,35.31 28.32,35.56 28.32,36.45 29.72,37.85 29.72,44.2 30.23,44.7 39.75,44.7 41.15,46.1 41.15,48.77 42.04,49.66 52.2,49.66 H1.35
PB12: length 40.3
  Top Layer w0.254: U2.73 28.58,38.9 28.58,45.21 29.24,45.87 38.89,45.87 40,46.99 40,49.91 40.83,50.74 50.49,50.74 51.18,51.43 51.18,53.47 H5.2
PB13: length 37.5
  Top Layer w0.254: U2.74 25.27,37.32 25.27,37.85 25.65,38.23 27.18,38.23 28.19,39.24 28.19,45.34 29.08,46.23 38.61,46.23 39.62,47.24 39.62,50.29 40.51,51.18 48.39,51.18 H5.1
PB15: length 34.9
  Top Layer w0.254: U2.76 22.7,38.48 v1(22.35,38.48)
  Bottom Layer w0.254: v1(22.35,38.48) 9.27,38.48 8.64,39.12 8.64,48.01 8,48.64 2.92,48.64 H3.35
PC0/K1: length 60.2
  Top Layer w0.254: H1.1 50.55,6.73 49.91,7.37 49.91,13.72 49.15,14.48 41.75,14.48 U2.26 35.43,20.8 v1(35.43,23.88) ; v1(46.61,43.05) 47.87,43.05 SW1.1
  Bottom Layer w0.254: v1(46.61,43.05) 45.72,42.16 36.45,42.16 35.43,41.15 v1(35.43,23.88)
PC1/K2: length 57
  Top Layer w0.254: H1.4 53.85,8.13 51.18,8.13 50.29,9.02 50.29,13.97 49.4,14.86 42.08,14.86 U2.27 36.07,20.87 v1(36.07,23.37) ; v1(46.61,38.99) SW2.1
  Bottom Layer w0.254: v1(46.61,38.99) 36.96,38.99 36.07,38.1 v1(36.07,23.37)
PC2: length 19.3
  Top Layer w0.254: U2.28 42.4,15.24 49.66,15.24 50.67,14.22 50.67,11.05 H1.3
PC3: length 21.5
  Top Layer w0.254: H1.6 53.72,10.54 51.94,10.54 51.18,11.3 51.18,14.35 49.91,15.62 42.73,15.62 39.29,19.06
PC4: length 20.3
  Top Layer w0.254: H1.13 48.26,26.16 48.26,29.84 47.62,30.48 43.62,30.48 42.2,29.06 41.44,29.06 39.29,26.91
PC5: length 23.5
  Top Layer w0.254: H1.16 53.72,23.24 51.82,23.24 48.64,26.42 48.64,30.35 48.13,30.86 43.5,30.86 42.23,29.59 41.26,29.59 38.94,27.26
PC6: length 15.7
  Top Layer w0.254: 18.36,28.68 16.05,30.99 9.4,30.99 8,29.59 H3.20
PC7: length 18.7
  Top Layer w0.254: H3.17 2.92,28.32 7.37,28.32 9.53,30.48 15.85,30.48 18,28.33
PC8: length 15.5
  Top Layer w0.254: H3.18 6.73,27.05 9.65,29.97 15.65,29.97 U2.98
PC9: length 18.5
  Top Layer w0.254: U2.99 15.45,29.46 9.78,29.46 6.1,25.78 2.92,25.78 H3.15
PC10: length 15.3
  Top Layer w0.254: U2.111 12.81,18.82 8.41,18.82 7.75,18.16 7.75,14.86 7.24,14.35 H3.8
PC11: length 17.1
  Top Layer w0.254: U2.112 7.78,13.08 2.92,13.08 H3.5
PC12: length 14.8
  Top Layer w0.254: 15.53,20.12 7.22,11.81 H3.6
PC13: length 11.2
  Top Layer w0.254: 37.21,4.19 35.56,5.84 32.64,5.84 32.26,6.22 32.26,10.54 31.51,11.28
PC14: length 8.3
  Top Layer w0.254: U2.8 32.64,10.86 32.64,7.84 X1.1 36.24,6.65 36.28,6.6
PC15: length 6.4
  Top Layer w0.254: 36.28,8 35.03,8 X1.2 33.82,10.39 U2.9
PD0: length 18.6
  Top Layer w0.254: U2.114 6.66,10.54 2.92,10.54 H3.3
PD1: length 16.2
  Top Layer w0.254: H3.4 6.09,9.27 U2.115
PD2: length 20
  Top Layer w0.254: 16.59,19.06 5.53,8 2.92,8 H3.1
PD3: length 17.7
  Top Layer w0.254: U2.117 4.97,6.73 H3.2
PD4: length 22.1
  Top Layer w0.254: U2.118 5.46,6.52 5.46,2.92 H2.2
PD5: length 18.3
  Top Layer w0.254: U2.119 6.73,7.08 H2.1
PD6: length 22.3
  Top Layer w0.254: U2.122 14.22,12.45 14.22,7.75 13.59,7.11 10.03,7.11 8,5.08 8,2.92 9.27,1.65
PD7: length 17.7
  Top Layer w0.254: 9.27,4.19 10.2,5.12 10.2,5.12 11.82,6.73 13.97,6.73 14.61,7.37 14.61,12.13 U2.123
PD8: length 36.5
  Top Layer w0.254: 25.08,35.4 25.08,35.38 v1(26.29,34.16) v1(27.18,33.27)
  Bottom Layer w0.254: H3.34 7.37,47.37 8.25,46.48 8.25,38.48 8.89,37.85 22.61,37.85 v1(26.29,34.16) v1(27.18,33.27)
PD9: length 32.5
  Top Layer w0.254: 24.72,35.04 22.55,37.21 v1(22.1,37.21)
  Bottom Layer w0.254: v1(22.1,37.21) 21.84,37.46 8.38,37.46 7.75,38.1 7.75,45.47 7.11,46.1 2.92,46.1 H3.33
PD10: length 34.2
  Top Layer w0.254: 25.53,33.53 25.65,33.4 ; 25.53,33.53 25.65,33.4 ; 25.53,33.53 v1(25.53,33.53) ; 25.53,33.53 24.37,34.69 ; 25.65,33.4 26.42,32.64 v1(26.42,32.64)
  Bottom Layer w0.254: H3.32 6.73,44.83 7.34,44.22 7.34,37.62 8,36.96 21.08,36.96 21.46,36.58 22.48,36.58 v1(25.53,33.53) v1(26.42,32.64)
PD11: length 30.6
  Top Layer w0.254: U2.80 22.41,35.94 v1(21.59,35.94)
  Bottom Layer w0.254: v1(21.59,35.94) 21.34,35.69 7.75,35.69 6.99,36.45 6.99,42.8 6.22,43.56 2.92,43.56 H3.31
PD12: length 31.9
  Top Layer w0.254: v1(25.78,31.88) v1(24.89,32.77) 24.88,32.77 U2.81
  Bottom Layer w0.254: H3.30 5.59,42.29 6.6,41.27 6.6,36.07 7.37,35.31 22.35,35.31 v1(24.89,32.77) v1(25.78,31.88)
PD13: length 28.1
  Top Layer w0.254: 23.31,33.63 22.27,34.67 v1(22.1,34.67)
  Bottom Layer w0.254: H3.29 2.92,41.02 5.72,41.02 6.2,40.54 6.2,35.71 7.24,34.67 v1(22.1,34.67)
PD14: length 31.2
  Top Layer w0.254: v1(24.64,30.73) 24,30.73 v1(23.5,31.24) 23.5,31.32 U2.85
  Bottom Layer w0.254: v1(23.5,31.24) 24,30.73 v1(24.64,30.73) 24.64,30.99 21.39,34.24 6.78,34.24 5.84,35.18 5.84,39.12 5.21,39.75 H3.28
PD15: length 25.2
  Top Layer w0.254: v1(20.57,33.65) 20.57,33.53 U2.86
  Bottom Layer w0.254: v1(20.57,33.65) 6.48,33.65 5.46,34.67 5.46,37.72 4.7,38.48 2.92,38.48 H3.27
PE0: length 12.1
  Top Layer w0.254: U2.141 24.13,8.92 24.13,7.75 26.52,5.36 27.79,5.36 28.32,4.83 28.32,2.92 H2.20
PE1: length 8.9
  Top Layer w0.254: H2.19 28.07,5.71 26.8,5.71 24.64,7.87 24.64,8.72 U2.142
PE2: length 8.8
  Top Layer w0.254: 29.39,9.16 30.1,8.45 30.1,5.59 30.86,4.83 30.86,2.67 31.88,1.65 H2.22
PE3: length 6.3
  Top Layer w0.254: U2.2 30.48,8.78 30.48,5.84 H2.21
PE4: length 21.5
  Top Layer w0.254: v1(29.84,14.35) 29.08,13.59 29.08,10.88 U2.3
  Bottom Layer w0.254: v1(29.84,14.35) 30.73,13.46 30.73,7.62 30.23,7.11 30.23,6.48 30.86,5.84 32.77,5.84 33.4,5.21 33.4,2.92 34.67,1.65
PE5: length 9.6
  Top Layer w0.254: v1(31.12,6.6) 31.24,6.73 31.24,9.43 U2.4
  Bottom Layer w0.254: 34.67,4.19 34.67,5.97 34.04,6.6 v1(31.12,6.6)
PE6: length 13.4
  Top Layer w0.254: 37.21,1.65 35.94,2.92 35.94,4.83 35.31,5.46 32.26,5.46 31.75,5.97 31.75,9.63 U2.5
PE7: length 20.3
  Top Layer w0.254: U2.58 38.93,36.45 51.69,36.45 H1.25
PE8: length 24.1
  Top Layer w0.254: U2.59 38.73,36.96 49.02,36.96 50.55,38.48 53.59,38.48 54.86,39.75 H1.28
PE9: length 22.4
  Top Layer w0.254: U2.60 38.4,37.34 48.77,37.34 49.53,38.1 49.53,39.12 50.17,39.75 H1.27
PE10: length 26.7
  Top Layer w0.254: 32.57,33.63 38.1,39.16 38.1,40.39 38.61,40.89 53.59,40.89 H1.30
PE11: length 24.4
  Top Layer w0.254: H1.29 51.56,41.4 38.35,41.4 37.72,40.77 37.72,39.48 U2.64
PE12: length 28.3
  Top Layer w0.254: U2.65 37.21,39.68 37.21,41.02 38.1,41.91 49.53,41.91 51.18,43.56 53.72,43.56 H1.32
PE13: length 33.1
  Top Layer w0.254: H1.31 50.93,46.35 50.93,48.39 50.42,48.89 42.55,48.89 41.91,48.26 41.91,45.85 40,43.94 37.34,43.94 36.83,43.43 36.83,40.01 31.51,34.69
PE14: length 36.4
  Top Layer w0.254: 31.16,35.04 36.45,40.33 36.45,43.81 36.96,44.32 39.88,44.32 41.53,45.97 41.53,48.51 42.29,49.28 50.67,49.28 51.31,48.64 51.31,46.48 51.69,46.1 53.72,46.1 H1.34
PE15: length 52.6
  Top Layer w0.254: H1.33 53.72,48.64 55.75,48.64 56.22,49.1 56.22,50.85 55.5,51.56 51.82,51.56 50.64,50.38 41.24,50.38 40.39,49.53 40.39,46.74 39.12,45.47 29.34,45.47 28.96,45.08 28.96,38.35 27.56,36.96 27.56,35.31 28.58,34.29 29.7,34.29 30.8,35.4
PF0: length 14.7
  Top Layer w0.254: H2.28 38.35,3.05 38.35,8.38 37.97,8.76 36.15,8.76 U2.10
PF1: length 12.4
  Top Layer w0.254: H2.27 38.74,5.21 38.74,8.76 38.35,9.14 36.48,9.14 32.93,12.7
PF2: length 16.6
  Top Layer w0.254: 33.28,13.05 36.81,9.52 38.61,9.52 39.12,9.02 39.12,6.1 39.62,5.59 40.39,5.59 41.02,4.95 41.02,2.92 H2.30
PF3: length 14.9
  Top Layer w0.254: H2.29 42.29,5.59 41.91,5.97 40.13,5.97 39.5,6.6 39.5,9.4 38.99,9.91 37.13,9.91 U2.13
PF4: length 19.1
  Top Layer w0.254: 44.83,1.65 43.56,2.92 43.56,5.97 43.18,6.35 40.64,6.35 39.88,7.11 39.88,9.65 39.24,10.29 37.46,10.29 33.99,13.76
PF5: length 17.2
  Top Layer w0.254: 44.83,4.19 44.83,6.35 44.45,6.73 41.02,6.73 40.26,7.49 40.26,9.78 39.37,10.67 37.78,10.67 U2.15
PF6: length 20.9
  Top Layer w0.254: U2.18 40.64,9.93 40.64,7.75 41.28,7.11 45.47,7.11 46.1,6.48 46.1,2.92 H2.34
PF7: length 19.1
  Top Layer w0.254: 35.75,15.53 41.02,10.26 41.02,8.13 41.66,7.49 46.74,7.49 47.37,6.86 H2.33
PF8: length 23.3
  Top Layer w0.254: U2.20 41.4,10.59 41.4,8.38 41.91,7.87 47.62,7.87 48.64,6.86 48.64,2.92 H2.36
PF9/TIM14_CH1: length 54.1
  Top Layer w0.254: v1(34.04,19.94) 34.04,18.66 U2.21 41.78,10.91 41.78,8.76 42.29,8.25 48.01,8.25 49.91,6.35 H2.35 ; LED1.1 47.92,34.42 v1(49.28,34.42)
  Bottom Layer w0.254: v1(34.04,19.94) 34.16,19.94 36.83,22.61 36.83,32.64 37.34,33.15 48.01,33.15 v1(49.28,34.42)
PF10: length 24.6
  Top Layer w0.254: U2.22 42.16,11.24 42.16,9.02 42.55,8.64 48.13,8.64 51.31,5.46 53.72,5.46 H1.2
PF11: length 22.3
  Top Layer w0.254: H1.20 53.72,28.32 51.82,28.32 50.17,29.97 50.17,31.75 49.53,32.38 41.23,32.38 37.52,28.68
PF12: length 19.2
  Top Layer w0.254: H1.19 51.18,29.59 50.55,30.23 50.55,32 49.78,32.77 40.9,32.77 37.17,29.03
PF13: length 23.2
  Top Layer w0.254: H1.22 53.72,30.86 51.56,30.86 51.05,31.37 51.05,32.38 50.29,33.15 42.8,33.15 41.58,34.37 40.38,34.37 U2.53
PF14: length 19.5
  Top Layer w0.254: H1.21 51.05,33.53 43.05,33.53 41.86,34.72 40.03,34.72 U2.54
PF15: length 22.7
  Top Layer w0.254: H1.24 53.72,33.4 51.82,33.4 50.04,35.18 39.78,35.18 U2.55
PG0: length 19.6
  Top Layer w0.254: U2.56 39.45,35.56 51.56,35.56 H1.23
PG1: length 22.7
  Top Layer w0.254: H1.26 53.85,36.07 39.25,36.07 U2.57
PG2: length 23.8
  Top Layer w0.254: H3.25 2.92,38.48 4.95,38.48 5.72,37.72 5.72,36.58 7.49,34.8 18.6,34.8 U2.87
PG3: length 19.4
  Top Layer w0.254: H3.26 6.99,34.42 18.28,34.42 U2.88
PG4: length 21.6
  Top Layer w0.254: H3.23 2.79,35.81 4.95,35.81 6.73,34.04 17.95,34.04 U2.89
PG5: length 17.9
  Top Layer w0.254: H3.24 5.21,33.65 17.63,33.65 U2.90
PG6: length 20.1
  Top Layer w0.254: U2.91 17.3,33.27 2.79,33.27 H3.21
PG7: length 17.1
  Top Layer w0.254: U2.92 16.97,32.89 9.78,32.89 9.02,32.13 H3.22
PG8: length 20.1
  Top Layer w0.254: H3.19 2.92,30.86 8.38,30.86 10.03,32.51 16.65,32.51 U2.93
PG9: length 20
  Top Layer w0.254: U2.124 14.99,11.8 14.99,6.98 14.35,6.35 12.32,6.35 10.54,4.57 10.54,2.92 H2.6
PG10: length 15.7
  Top Layer w0.254: H2.5 13.59,5.97 14.73,5.97 15.37,6.6 15.37,11.47 U2.125
PG11: length 18
  Top Layer w0.254: 20.13,15.53 15.75,11.15 15.75,6.35 14.99,5.59 13.84,5.59 13.08,4.83 13.08,2.92 H2.8
PG12: length 13.5
  Top Layer w0.254: H2.7 16.13,5.97 16.13,10.82 U2.127
PG13: length 15.9
  Top Layer w0.254: U2.128 16.51,10.5 16.51,5.71 15.62,4.83 15.62,2.92 16.89,1.65
PG14: length 12.1
  Top Layer w0.254: 16.89,4.19 16.89,10.17 U2.129
PG15: length 14
  Top Layer w0.254: H2.12 18.16,2.92 18.16,5.33 19.05,6.22 19.05,10.21 U2.132
PH0: length 13.8
  Top Layer w0.254: 44.73,11.43 42.68,11.43 U2.23 ; 44.73,11.43 45.21,10.95 45.21,10.16 45.54,9.83 45.54,9.4 43.98,9.4 ; 44.73,11.43 X2.1
PH1: length 17.2
  Top Layer w0.254: 46.85,13.19 46.62,13.19 45.72,14.1 40.72,14.1 U2.24 ; 46.85,13.19 X2.3 ; 46.85,13.19 45.85,12.19 45.85,10.41 46.41,9.85 R7.2 C12.2
POWER: length 29.6
  Top Layer w0.254: C15.2 12.52,8.09 D1.3 13.43,8.04 v1(13.46,8) ; U2.6 29.72,12.37 v1(29.72,13.08)
  Bottom Layer w0.254: v1(29.72,13.08) 29.72,7.62 28.83,6.73 25.96,6.73 23.8,8.89 14.35,8.89 v1(13.46,8)
RST: length 93.3
  Top Layer w0.254: v1(25.53,29.59) 25.53,22.1 26.42,21.21 v1(34.29,21.21) 34.31,21.21 37.88,17.65 ; v1(13.08,43.81) D2.2 ; v1(48.26,45.47) 49.48,45.47 R9.1 C14.1 47.93,47.08 SW3.1
  Bottom Layer w0.254: v1(25.53,29.59) 25.53,30.1 28.83,33.4 28.83,35.18 23.62,40.39 13.72,40.39 13.08,41.02 v1(13.08,43.81) ; v1(48.26,45.47) 35.05,45.47 33.78,44.2 33.78,21.72 v1(34.29,21.21)
RTS: length 5
  Top Layer w0.254: U6.13 18.26,40.32 17.59,39.64 17.59,37.98 R16.1
VREF: length 62.8
  Top Layer w0.254: 46.94,18.18 46.95,18.16 ; 46.94,18.18 46.94,17.6 46.48,17.14 43.33,17.14 28.45,32.02 v1(28.45,32.13) ; 46.94,18.18 R11.2
  Bottom Layer w0.254: v1(28.45,32.13) 29.21,32.89 29.21,35.43 23.75,40.89 14.22,40.89 13.72,41.4 13.72,52.83 13.59,52.96 13.59,53.47 H4.2
$1N3432: length 5.5
  Top Layer w0.254: R1.1 26.8,6.35 25.15,8 25.15,8.53 U2.143
$1N3503: length 5.2
  Top Layer w0.254: U2.106 13.81,26.16 12.83,26.16 12.23,25.56 C19.1
$1N3607: length 4
  Top Layer w0.254: U2.71 32.52,39.24 C22.2
$1N5532: length 16.1
  Top Layer w0.254: v1(13.46,9.4) 13.52,9.46 D1.1
  Bottom Layer w0.254: 28.07,10.32 27.14,9.4 v1(13.46,9.4)
$1N6115: length 2.9
  Top Layer w0.254: LED2.2 12.19,42.38 12.19,40.51 11.81,40.13 11.36,40.13
$1N7262: length 2.6
  Top Layer w0.254: R15.1 18.44,46.94 USB1.B5
$1N7303: length 2.5
  Top Layer w0.254: R17.1 21.44,46.93 USB1.A5
$1N7864: length 2.8
  Top Layer w0.254: C24.2 22.06,44.92 21.63,44.49 U6.6
$1N8061: length 1.7
  Top Layer w0.254: 26.48,46.26 26.48,44.67 TX1.2
$1N8103: length 1.6
  Top Layer w0.254: R20.2 24.64,44.62 RX1.2
$1N8304: length 1.9
  Top Layer w0.254: Q2.1 15.63,39.7 R14.2
$1N8343: length 3.8
  Top Layer w0.254: Q2.3 16.64,43.78 D2.1 18.21,43.81 R13.1
$1N8469: length 1.6
  Top Layer w0.254: R16.2 15.39,37.97 Q3.1
$1N18412: length 1.6
  Top Layer w0.254: LED1.2 46.31,34.42 R3.2
$1N26831: length 2.8
  Top Layer w0.254: Q3.3 14.18,35.76 R18.2

## Copper pours and planes (outline as drawn; the poured copper is in the pictures)
3V3 on VCC: -0.76,57.15 58.04,57.15 58.04,-1.4 -0.76,-1.4
+5V on VCC: 9.73,53.72 45.85,53.72 45.85,40.15 9.73,40.15
GND on Top Layer: -0.89,57.4 57.78,57.4 57.78,-1.02 -0.89,-1.02
GND on Bottom Layer: -0.51,57.15 57.15,57.15 57.15,-1.02 -0.51,-1.02
GND on GND: 0.26,56.26 56.39,56.26 56.39,0.26 0.26,0.26
VBUS on VCC: 14.1,51.43 22.61,51.43 22.61,45.34 14.1,45.34

Small or netless copper shapes (teardrops, artwork), in the pictures only: 785 on Top Layer, 128 on Bottom Layer, 27 on GND

## Text on the board
Bottom Silkscreen Layer: VREF | D0 | D2 | D9 | B15 | D11 | D13 | D15 | G2 | G4 | G6 | G8 | C7 | C9 | A9 | A11 | A13 | A15 | C11 | 3V | D5 | D4 | D1 | D8 | D3 | B14 | T1 | D10 | D12 | D14 | G3 | G5 | G7 | C6 | C8 | A8 | A10 | A12 | A14 | C10 | C12 | T0 | D7 | D6 | G | G10 | G9 | G12 | G11 | G14 | G13 | B3 | G15 | B5 | B4 | B7 | B6 | B9 | B8 | E1 | E0 | E3 | E2 | E5 | E4 | C13 | E6 | F1 | F0 | F3 | F2 | 5V | F5 | F4 | F7 | F6 | E13 | E11 | E9 | E7 | G0 | F14 | F12 | B2 | B0 | C4 | A6 | A4 | A2 | A0 | B11 | E15 | C2 | C0 | F9 | F8 | B12 | B13 | E12 | E10 | E8 | G1 | F15 | F13 | F11 | B1 | C5 | A7 | A5 | A3 | A1 | C3 | B10 | E14 | C1 | F10
Top Silkscreen Layer: 24.11.08 | F4-ZGT6-V1.1 | K1/C0 | K2/C1 | 复位 | LED/F9 | 3V3 / DIO / CLK / GND
